# Altium project UZ_D_Resolver.PrjPCB (part 1 of 2)
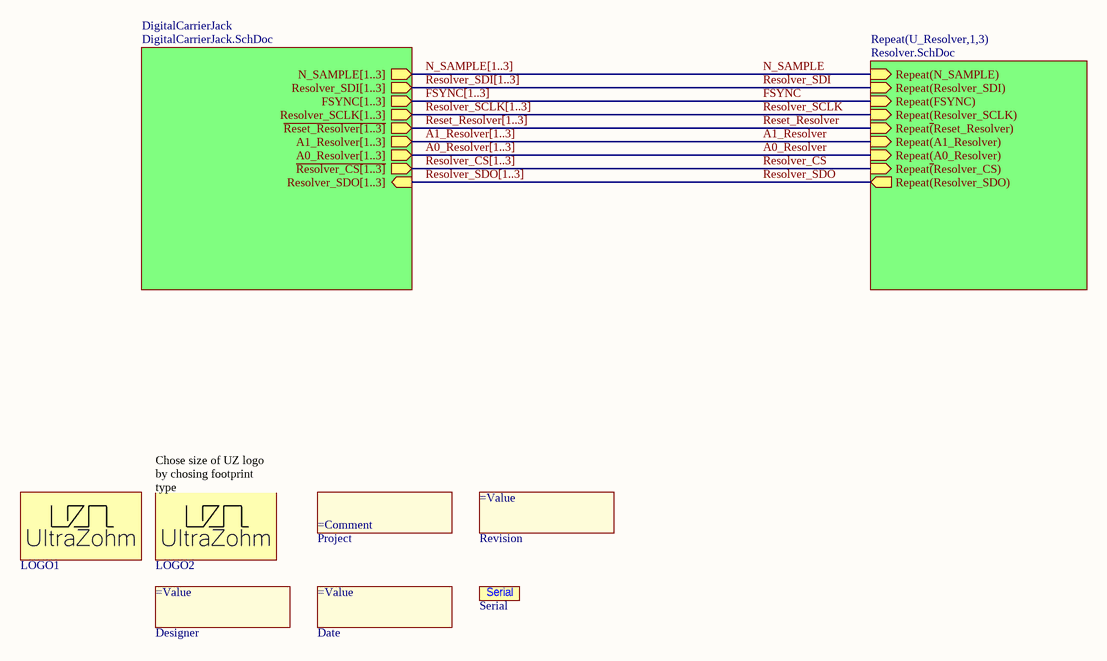
[diagram p0: TopSheet.SchDoc]
Author: M. Bauer / A. Geiger; AuthorParam: M. Bauer / A. Geiger; FinDate: 12/2023; ProjectNameCustom: UZ_D_Resolver; ProjectRevision: Rev02
6 sheets, 372 parts. Net scope: hierarchical (ports join the sheet entries above them; power ports are global).
Board file: UltraZohm_Digital_Resolver.PcbDoc
Sheets:
  TopSheet.SchDoc
    DigitalCarrierJack = DigitalCarrierJack.SchDoc
    U_Resolver1 = Resolver.SchDoc
      Buffer_EXC = Buffer_EXC.SchDoc
      Impedance Converter = Impedance converter.SchDoc
      U_Resolver fuses = Resolver fuses.SchDoc
    U_Resolver2 = Resolver.SchDoc
      Buffer_EXC = Buffer_EXC.SchDoc
      Impedance Converter = Impedance converter.SchDoc
      U_Resolver fuses = Resolver fuses.SchDoc
    U_Resolver3 = Resolver.SchDoc
      Buffer_EXC = Buffer_EXC.SchDoc
      Impedance Converter = Impedance converter.SchDoc
      U_Resolver fuses = Resolver fuses.SchDoc

## Sheet TopSheet.SchDoc: Resolver
size A4; Author: M. Bauer / A. Geiger; CompanyName: Technische Hochschule Nürnberg Georg Simon Ohm; DrawnBy: Bauer Martin; Engineer: Bauer Martin; Organization: UltraZohm; Address1: Kesslerplatz 12; Address2: 90489 Nürnberg; Address3: GERMANY; DocumentNumber: 1; Revision: A; SheetNumber: 1; SheetTotal: 6; Website: www.ultrazohm.com

### Parts
Date  (no value)  [COMMENT]  (no BOM)
Designer  (no value)  [Designator:comment]  (no BOM)
LOGO1  UZ Logo  [UZ_Logo_large]  (value not drawn)  (no BOM)
LOGO2  UZ Logo  [UZ_Logo_tiny]  (value not drawn)  (no BOM)
Project  (no value)  [COMMENT]  (no BOM)
Revision  (no value)  [Designator:comment]  (no BOM)
Serial  Serial #  [SERIAL]  (value not drawn)

### Sub-sheets
DigitalCarrierJack = DigitalCarrierJack.SchDoc: ~{Resolver_CS[1..3]} (out), A1_Resolver[1..3] (out), ~{Reset_Resolver[1..3]} (out), FSYNC[1..3] (out), N_SAMPLE[1..3] (out), A0_Resolver[1..3] (out), Resolver_SCLK[1..3] (out), Resolver_SDO[1..3] (in), Resolver_SDI[1..3] (out)
Repeat(U_Resolver,1,3) = Resolver.SchDoc: Repeat(N_SAMPLE) (in), Repeat(Resolver_SDO) (out), Repeat(Resolver_SDI) (in), Repeat(FSYNC) (in), Repeat(Resolver_SCLK) (in), Repeat~{(}Reset_Resolver) (in), Repeat(A1_Resolver) (in), Repeat(A0_Resolver) (in), Repeat~{(}Resolver_CS) (in)

### Nets
~{Reset_Resolver}: sheet Repeat(U_Resolver,1,3)/Repeat~{(}Reset_Resolver)
~{Resolver_CS}: sheet Repeat(U_Resolver,1,3)/Repeat~{(}Resolver_CS)
A0_Resolver: sheet Repeat(U_Resolver,1,3)/Repeat(A0_Resolver)
A1_Resolver: sheet Repeat(U_Resolver,1,3)/Repeat(A1_Resolver)
FSYNC: sheet Repeat(U_Resolver,1,3)/Repeat(FSYNC)
N_SAMPLE: sheet Repeat(U_Resolver,1,3)/Repeat(N_SAMPLE)
Resolver_SCLK: sheet Repeat(U_Resolver,1,3)/Repeat(Resolver_SCLK)
Resolver_SDI: sheet Repeat(U_Resolver,1,3)/Repeat(Resolver_SDI)
Resolver_SDO: sheet Repeat(U_Resolver,1,3)/Repeat(Resolver_SDO)

### Buses and harness runs
bus A0_Resolver[1..3] = sheet DigitalCarrierJack/A0_Resolver[1..3]
bus A1_Resolver[1..3] = sheet DigitalCarrierJack/A1_Resolver[1..3]
bus FSYNC[1..3] = sheet DigitalCarrierJack/FSYNC[1..3]
bus N_SAMPLE[1..3] = sheet DigitalCarrierJack/N_SAMPLE[1..3]
bus Resolver_SCLK[1..3] = sheet DigitalCarrierJack/Resolver_SCLK[1..3]
bus Resolver_SDI[1..3] = sheet DigitalCarrierJack/Resolver_SDI[1..3]
bus Resolver_SDO[1..3] = sheet DigitalCarrierJack/Resolver_SDO[1..3]
bus ~{Reset_Resolver[1..3]} = sheet DigitalCarrierJack/~{Reset_Resolver[1..3]}
bus ~{Resolver_CS[1..3]} = sheet DigitalCarrierJack/~{Resolver_CS[1..3]}

### Notes on the sheet
- (near LOGO2) Chose size of UZ logo by chosing footprint type
- Title
- Revision:
- Design Engineer:
- Date:
- Project:
- Sheet
- of

### Library data of the parts
Date = 5: Create a project parameter named "FinDate" this is the value of this component. It is printed on the PCB. Once the parameter is updated (e.g. new revision) it gets updated on the PCB as well; Manufacturer: PCB Manufacturer; Manufacturer Part Number: Project End Date; Value: 12/2023; Created from: T. Wendt; PartID: 5; Created On: 01.03.2021 09:01:41; Component Type: Date of Project Finalization; Last Updated: 01.03.2021 09:01:41; Type: Standard (No BOM); Live Cycle Status: 1
Designer = 4: Create a project parameter named "Author" this is the value of this component. It is printed on the PCB. Once the parameter is updated (e.g. new revision) it gets updated on the PCB as well; Manufacturer: PCB Manufacturer; Manufacturer Part Number: Project Author; Value: M. Bauer / A. Geiger; Created from: T. Wendt; PartID: 4; Created On: 01.03.2021 08:53:41; Component Type: Project Author; Last Updated: 01.03.2021 09:20:27; Type: Standard (No BOM); Live Cycle Status: 1
LOGO1 LOGO2 = 1: Official Project Logo of the UltraZohm; Manufacturer: PCB Manufacturer; Manufacturer Part Number: UltraZohm Logo; Created from: T. Wendt; PartID: 1; Created On: 19.02.2021 16:55:56; ComponentLink1Description: Homepage; ComponentLink1URL: https://ultrazohm.com; Component Type: Logo; Last Updated: 02.03.2021 14:31:24; Type: Standard (No BOM); Live Cycle Status: 1
Project = 2: Create a project parameter named "ProjectNameCustom" this is the value of this component and it is printed on the PCB.; Manufacturer: PCB Manufacturer; Value: UZ_D_Resolver; Created from: T. Wendt; PartID: 2; Created On: 01.03.2021 08:43:57; Component Type: Project Name; Last Updated: 01.03.2021 09:07:27; Manufacturer Part Number: Project Name; Type: Standard (No BOM); Live Cycle Status: 1
Revision = 3: Create a project parameter named "ProjectRevision" this is the value of this component. It is printed on the PCB. Once the parameter is updated (e.g. new revision) it gets updated on the PCB as well; Manufacturer: PCB Manufacturer; Value: Rev02; Created from: T. Wendt; PartID: 3; Created On: 01.03.2021 08:50:34; Component Type: Project Revision; Last Updated: 01.03.2021 09:28:36; Manufacturer Part Number: Project Revision; Type: Standard (No BOM); Live Cycle Status: 1
Serial = 6: Field to put in a serial number; Manufacturer: PCB Manufacturer; Created from: T. Wendt; PartID: 6; Created On: 02.03.2021 14:31:24; Component Type: Serial Number; Last Updated: 02.03.2021 14:31:24; Manufacturer Part Number: Serial Number; Type: Standard (No BOM); Live Cycle Status: 1

## Sheet DigitalCarrierJack.SchDoc
size A4; Author: M. Bauer / A. Geiger; CompanyName: Technische Hochschule Nürnberg Georg Simon Ohm; DrawnBy: Bauer Martin; Engineer: Bauer Martin; Organization: UltraZohm; Address1: Kesslerplatz 12; Address2: 90489 Nürnberg; Address3: GERMANY; DocumentNumber: 2; SheetNumber: 2; SheetTotal: 6; Website: www.ultrazohm.com
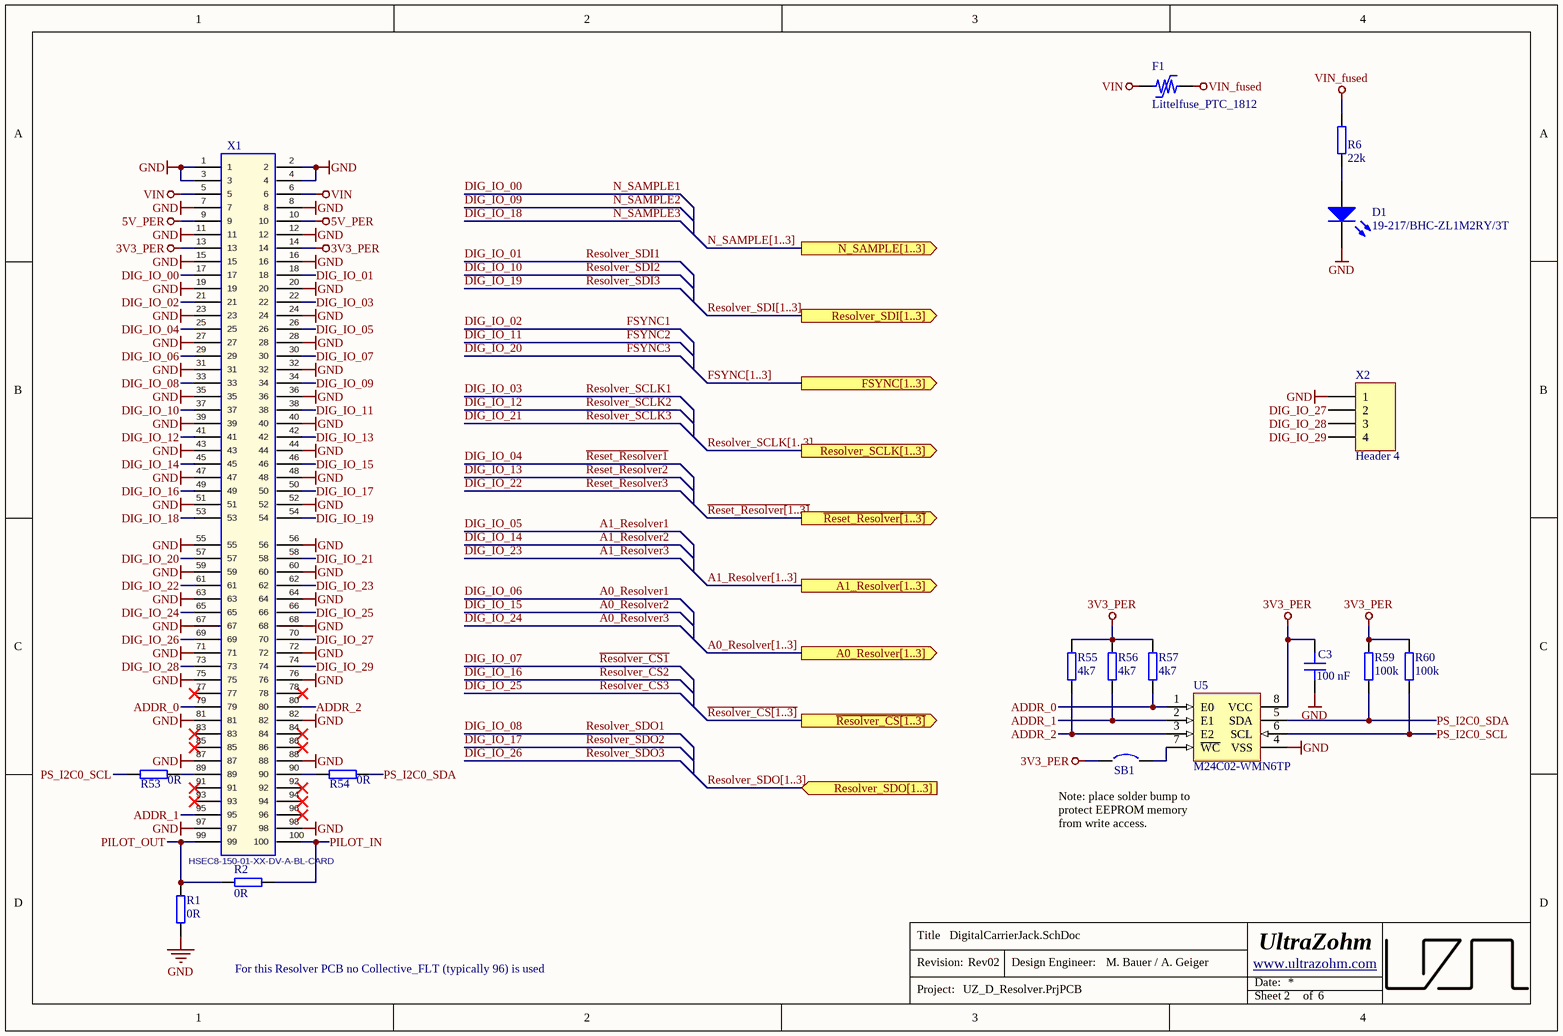
[diagram p1: DigitalCarrierJack.SchDoc]

### Parts
C3  100 nF  [C_0603]
D1  19-217/BHC-ZL1M2RY/3T  [WL-SMCW_0603]
F1  Littelfuse_PTC_1812  [1812_PTC_Polyfuse_Littelfuse]
R1  0R  [RES 0603_1608]
R2  0R  [RES 0603_1608]
R6  22k  [RES 0603_1608]
R53  0R  [RES 0603_1608]
R54  0R  [RES 0603_1608]
R55  4k7  [RES 0603_1608]
R56  4k7  [RES 0603_1608]
R57  4k7  [RES 0603_1608]
R59  100k  [RES 0603_1608]
R60  100k  [RES 0603_1608]
SB1  Solder Bump 0603  [SB_0603]  (value not drawn)  (no BOM)
U5  M24C02-WMN6TP  [D0008A_N]
X1  HSEC8-150-01-XX-DV-A-BL-CARD  [HSEC8-150-01-XX-DV-A-BL-CARD]  (no BOM)
X2  Header 4  [HDR1X4]

### Ports
A0_Resolver[1..3] (out), A1_Resolver[1..3] (out), FSYNC[1..3] (out), N_SAMPLE[1..3] (out), Resolver_SCLK[1..3] (out), Resolver_SDI[1..3] (out), Resolver_SDO[1..3] (in), ~{Reset_Resolver[1..3]} (out), ~{Resolver_CS[1..3]} (out)

### Nets
3V3_PER: C3.1 R55.2 R56.2 R57.2 R59.2 R60.2 SB1.1 U5.8(VCC) X1.13 X1.14
5V_PER: X1.9 X1.10
GND: C3.2 D1.1(K) R1.1 U5.4(VSS) X1.1 X1.2 X1.3 X1.4 X1.7 X1.8 X1.11 X1.12 X1.15 X1.16 X1.19 X1.20 X1.23 X1.24 X1.27 X1.28 X1.31 X1.32 X1.35 X1.36 X1.39 X1.40 X1.43 X1.44 X1.47 X1.48 X1.51 X1.52 X1.55 X1.56 X1.59 X1.60 X1.63 X1.64 X1.67 X1.68 X1.71 X1.72 X1.75 X1.76 X1.81 X1.82 X1.87 X1.88 X1.97 X1.98 X2.1
VIN: F1.1 X1.5 X1.6
VIN_fused: F1.2 R6.2
~{Reset_Resolver1}: X1.25  [also labelled DIG_IO_04]  [project net ~{Reset_Resolver}]
~{Reset_Resolver2}: X1.42  [also labelled DIG_IO_13]  [project net ~{Reset_Resolver}]
~{Reset_Resolver3}: X1.61  [also labelled DIG_IO_22]  [project net ~{Reset_Resolver}]
~{Resolver_CS1}: X1.30  [also labelled DIG_IO_07]  [project net ~{Resolver_CS}]
~{Resolver_CS2}: X1.49  [also labelled DIG_IO_16]  [project net ~{Resolver_CS}]
~{Resolver_CS3}: X1.66  [also labelled DIG_IO_25]  [project net ~{Resolver_CS}]
A0_Resolver1: X1.29  [also labelled DIG_IO_06]
A0_Resolver2: X1.46  [also labelled DIG_IO_15]
A0_Resolver3: X1.65  [also labelled DIG_IO_24]
A1_Resolver1: X1.26  [also labelled DIG_IO_05]
A1_Resolver2: X1.45  [also labelled DIG_IO_14]
A1_Resolver3: X1.62  [also labelled DIG_IO_23]
ADDR_0: R57.1 U5.1(E0) X1.79
ADDR_1: R56.1 U5.2(E1) X1.95
ADDR_2: R55.1 U5.3(E2) X1.80
DIG_IO_00: X1.17  [also labelled N_SAMPLE1]
DIG_IO_01: X1.18  [also labelled Resolver_SDI1]
DIG_IO_02: X1.21  [also labelled FSYNC1]
DIG_IO_03: X1.22  [also labelled Resolver_SCLK1]
DIG_IO_08: X1.33  [also labelled Resolver_SDO1]
DIG_IO_09: X1.34  [also labelled N_SAMPLE2]
DIG_IO_10: X1.37  [also labelled Resolver_SDI2]
DIG_IO_11: X1.38  [also labelled FSYNC2]
DIG_IO_12: X1.41  [also labelled Resolver_SCLK2]
DIG_IO_17: X1.50  [also labelled Resolver_SDO2]
DIG_IO_18: X1.53  [also labelled N_SAMPLE3]
DIG_IO_19: X1.54  [also labelled Resolver_SDI3]
DIG_IO_20: X1.57  [also labelled FSYNC3]
DIG_IO_21: X1.58  [also labelled Resolver_SCLK3]
DIG_IO_26: X1.69  [also labelled Resolver_SDO3]
DIG_IO_27: X1.70 X2.2
DIG_IO_28: X1.73 X2.3
DIG_IO_29: X1.74 X2.4
PILOT_IN: R2.2 X1.100
PILOT_OUT: R1.2 R2.1 X1.99
PS_I2C0_SCL: R53.1 R60.1 U5.6(SCL)
PS_I2C0_SDA: R54.2 R59.1 U5.5(SDA)
NetD1_2: D1.2(A) R6.1
NetR53_2: R53.2 X1.89
NetR54_1: R54.1 X1.90
NetSB1_2: SB1.2 U5.7(~{WC})

Not connected (* = marked no-connect by the designer): X1 77* 78* 83* 84* 85* 86* 91* 92* 93* 94* 96*

### Buses and harness runs
bus A0_Resolver[1..3] = port A0_Resolver[1..3]
bus A1_Resolver[1..3] = port A1_Resolver[1..3]
bus FSYNC[1..3] = port FSYNC[1..3]
bus N_SAMPLE[1..3] = port N_SAMPLE[1..3]
bus Resolver_SCLK[1..3] = port Resolver_SCLK[1..3]
bus Resolver_SDI[1..3] = port Resolver_SDI[1..3]
bus Resolver_SDO[1..3] = port Resolver_SDO[1..3]
bus ~{Reset_Resolver[1..3]} = port ~{Reset_Resolver[1..3]}
bus ~{Resolver_CS[1..3]} = port ~{Resolver_CS[1..3]}

### Notes on the sheet
- Note: place solder bump to protect EEPROM memory from write access.
- For this Resolver PCB no Collective_FLT (typically 96) is used
- Title
- Revision:
- Design Engineer:
- Date:
- Project:
- Sheet
- of

### Library data of the parts
C3 = C0603C104K9PACTU: Capacitor 0603, 6.3 VDC, 100 nF, X5R; Manufacturer: KEMET; Tolerance: 10 %; Voltage Rating: 6.3 VDC; Created from: MGremer; Manufacturer Part Number: C0603C104K9PACTU; PartID: 70; Created On: 20.12.2020 13:54:13; ComponentLink1Description: Datasheet; ComponentLink1URL: https://www.mouser.de/datasheet/2/212/KEM_C1006_X5R_SMD-1103249.pdf; Component Type: Capacitor 0603; Device Package: 0603; Last Updated: 20.01.2021 13:57:36; Mounting Type: SMD; Operating Temperature: -55 - 85°C; Series: SMD Comm X5R; Supplier 1: Mouser; Supplier Part Number 1: 80-C0603C104K9P; Type: Capacitor; Value: 100 nF; Live Cycle Status: 1; Stock number: not stored
D1 = 19-217/BHC-ZL1M2RY/3T: LED BLUE 465~475NM 11.5~28.5MCD@5MA TOP VIEW 0603 ROHS; Manufacturer: Everlight Elec; Type: Standard; Created from: T. Wendt; Forward Current I_f: 20 mA; Forward Voltage U_f: 2.8 V; Wavelength: 470 nm; Nominal Power: 68 mW; Manufacturer Part Number: 19-217/BHC-ZL1M2RY/3T; PartID: 6; Created On: 03.03.2021 09:59:51; ComponentLink1Description: Datasheet; ComponentLink1URL: https://datasheet.lcsc.com/szlcsc/Everlight-Elec-19-217-BHC-ZL1M2RY-3T_C72041.pdf; Component Type: LED Diode; Device Package: 0603; Last Updated: 04.03.2021 09:02:49; Mounting Type: SMD; Operating Temperature: -40 - 85 °C; Supplier 1: LCSC; Supplier Part Number 1: C72041; Live Cycle Status: 1; Stock number: not stored; Color: blue; Light Intensity: 28.5 mcd; LCSC Part Number: C72041
F1 = Littelfuse_PTC_1812: POLYSWITCH RESETTABLE DEVICES; MPN: miniASMDC110F/24; Value: PTC, 1.1 A, 24V; Voltage: 24V; Trip Current: 2.2A; Hold Current: 1.1A; Resistance: 0.18 Ohm; Type: Fuse; Nominal current: 1 A; Created from: MHlatky; MF: Littelfuse; Created: 2019_02_10_AGeiger; Package: 1812; ComponentLink1URL: https://www.littelfuse.com/~/media/electronics/datasheets/resettable_ptcs/littelfuse_ptc_surface_mount_catalog_datasheet.pdf.pdf; ComponentLink1Description: Datasheet; Manufacturer Part Number: Littelfuse_PTC_1812; PartID: 5; Created On: 07.05.2021 06:50:33; Component Type: Littelfuse_PTC_1812; Last Updated: 27.05.2022 15:06:17; Manufacturer: Littelfuse; Mounting Type: SMD; Operating Temperature: -40 - 85 °C; Supplier 1: Mouser; Supplier Part Number 1: 530-0ZCG0150BF2C; Live Cycle Status: 1; LCSC Part Number: C70119
R1 R2 R53 R54 = RC0603JR-070RL: SMD resistor E24 series; Manufacturer: YAGEO; Tolerance: 5%; Created from: MGremer; Supplier 1: Mouser; ComponentLink1Description: Datasheet; ComponentLink1URL: https://www.mouser.de/datasheet/2/447/PYu-RC_Group_51_RoHS_L_10-1664068.pdf; Value: 0R; Supplier Part Number 1: 603-RC0603JR-070RL; Manufacturer Part Number: RC0603JR-070RL; PartID: 1; Created On: 14.12.2020 16:17:14; Component Type: SMD resistor; Device Package: 0603; Last Updated: 04.03.2021 09:09:42; Mounting Type: SMD; Supplier 2: LCSC; Supplier Part Number 2: C21189; Type: Resistor; Live Cycle Status: 1; Stock number: Labor SMD Container; LCSC Part Number: C21189
R6 = RK73B1JTTD223J: SMD resistor E24 series; Manufacturer: KOA Speer; Tolerance: 5%; Created from: MGremer; Value: 22k; Supplier 1: Mouser; Supplier Part Number 1: 660-RK73B1JTTD223J; Manufacturer Part Number: RK73B1JTTD223J; PartID: 106; Created On: 14.12.2020 16:17:14; ComponentLink1Description: Datasheet; ComponentLink1URL: https://www.mouser.de/datasheet/2/219/RK73B-1825463.pdf; Component Type: SMD resistor; Device Package: 0603; Last Updated: 01.02.2023 09:52:31; Mounting Type: SMD; Type: Resistor; Live Cycle Status: 1; Stock number: Labor SMD Container; LCSC Part Number: C31850
R55-R57 = 0603WAF4701T5E: SMD resistor E24 series; Manufacturer: UNI-ROYAL; Tolerance: 1%; Created from: AGeiger; Manufacturer Part Number: 0603WAF4701T5E; PartID: 90; Created On: 14.12.2020 16:17:14; ComponentLink1Description: Datasheet; ComponentLink1URL: https://datasheet.lcsc.com/lcsc/2206010116_UNI-ROYAL-Uniroyal-Elec-0603WAF4701T5E_C23162.pdf; Component Type: SMD resistor; Device Package: 0603; Last Updated: 25.08.2022 20:03:04; Mounting Type: SMD; Supplier 1: LCSC; Supplier Part Number 1: C23162; Type: Resistor; Value: 4k7; Live Cycle Status: 1; Stock number: Labor SMD Container; LCSC Part Number: C23162
R59 R60 = RK73B1JTTD104J: SMD resistor E24 series; Manufacturer: KOA Speer; Tolerance: 5%; Created from: MGremer; Manufacturer Part Number: RK73B1JTTD104J; PartID: 122; Created On: 14.12.2020 16:17:14; ComponentLink1Description: Datasheet; ComponentLink1URL: https://www.mouser.de/datasheet/2/219/RK73B-1825463.pdf; Component Type: SMD resistor; Device Package: 0603; Last Updated: 27.05.2022 14:04:10; Mounting Type: SMD; Supplier 1: Mouser; Supplier Part Number 1: 660-RK73B1JTTD104J; Type: Resistor; Value: 100k; Live Cycle Status: 1; Stock number: Labor SMD Container; LCSC Part Number: C25803
SB1 = =Value: Created from: AGeiger; Revision: July-2002: Re-released for DXP Platform.; PartID: 1; Created On: 09.01.2024 17:13:56; Component Type: Solder Bump; Device Package: 0603; Last Updated: 09.01.2024 17:13:56; Manufacturer Part Number: Solder Bump 0603; Mounting Type: SMD; Value: Solder Bump 0603
U5 = M24C02-WMN6TP: 2Kbit I2C SOP-8 EEPROM ROHS; Manufacturer: STMicroelectronics; Created from: AGeiger; Manufacturer Part Number: M24C02-WMN6TP; PartID: 1; Created On: 19.11.2023 14:54:27; ComponentLink1Description: Datasheet; ComponentLink1URL: https://www.st.com/resource/en/datasheet/m24c01-w.pdf; Component Type: EEPROM; Device Package: SOIC-8; Last Updated: 19.11.2023 21:39:04; Mounting Type: SMD; Operating Temperature: -40 to +85 °C; Series: M24xxx; Supplier 1: Mouser; Supplier Part Number 1: 511-M24C02-WMN6TP; Supplier 2: LCSC; Supplier Part Number 2: C7562; Type: Memory; Value: M24C02-WMN6TP; LCSC Part Number: C7562
X1 = HSEC8-150-01-XX-DV-A-BL-CARD: Mating Card Layout for HSEC8-150-01-XX-DV-A-BL; Manufacturer: SAMTEC; Created: 2018_04_23_AGeiger; Value: HSEC8-150-01-XX-DV-A-BL-CARD
X2 = Header 4: Header, 4-Pin; LatestRevisionDate: 17-Jul-2002; LatestRevisionNote: Re-released for DXP Platform.; Publisher: Altium Limited

## Sheet Resolver.SchDoc
size A4; Author: M. Bauer / A. Geiger; CompanyName: Technische Hochschule Nürnberg Georg Simon Ohm; DrawnBy: Bauer Martin; Engineer: Bauer Martin; Organization: UltraZohm; Address1: Kesslerplatz 12; Address2: 90489 Nürnberg; Address3: GERMANY; DocumentNumber: 3; SheetNumber: 3; SheetTotal: 6; Website: www.ultrazohm.com
Used 3 times, as channels U_Resolver1, U_Resolver2, U_Resolver3. Parts and nets are listed once, with the designators drawn on the sheet.
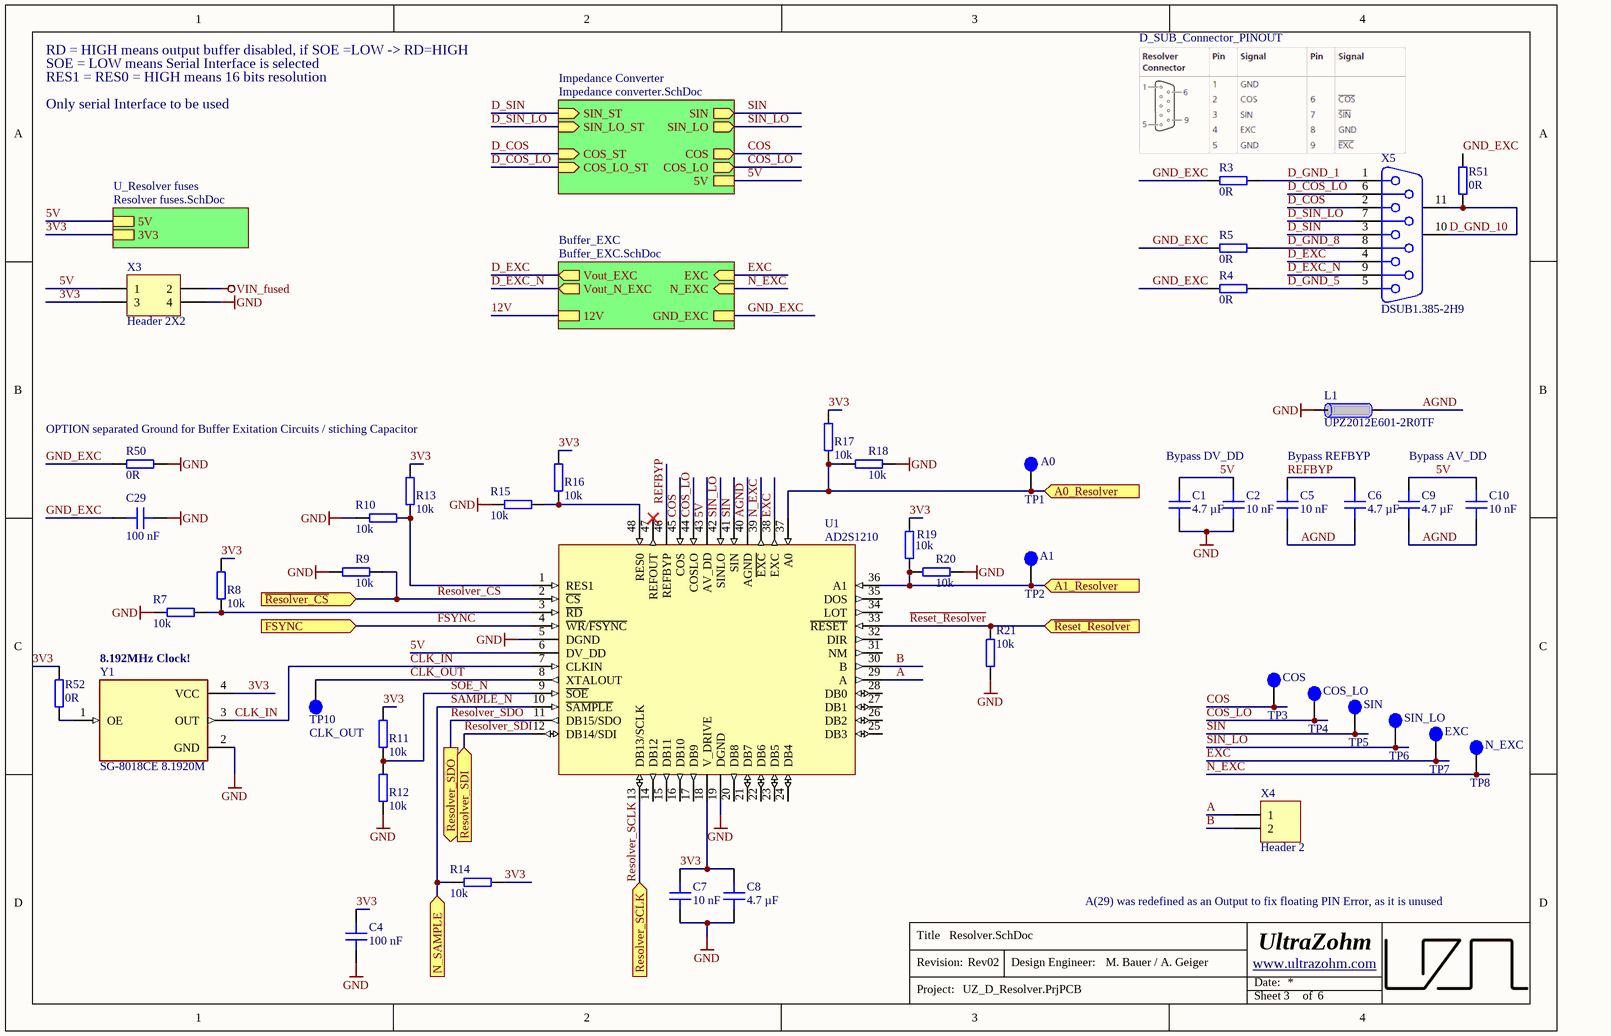
[diagram p2: Resolver.SchDoc]

### Parts
C1  4.7 µF  [C_0603]
C2  10 nF  [C_0603]
C4  100 nF  [C_0603]
C5  10 nF  [C_0603]
C6  4.7 µF  [C_0603]
C7  10 nF  [C_0603]
C8  4.7 µF  [C_0603]
C9  4.7 µF  [C_0603]
C10  10 nF  [C_0603]
C29  100 nF  [C_0603]
L1  UPZ2012E601-2R0TF  [INDC2012X92N_V]
R3  0R  [RES 0603_1608]
R4  0R  [RES 0603_1608]
R5  0R  [RES 0603_1608]
R7  10k  [RES 0603_1608]
R8  10k  [RES 0603_1608]
R9  10k  [RES 0603_1608]
R10  10k  [RES 0603_1608]
R11  10k  [RES 0603_1608]
R12  10k  [RES 0603_1608]
R13  10k  [RES 0603_1608]
R14  10k  [RES 0603_1608]
R15  10k  [RES 0603_1608]
R16  10k  [RES 0603_1608]
R17  10k  [RES 0603_1608]
R18  10k  [RES 0603_1608]
R19  10k  [RES 0603_1608]
R20  10k  [RES 0603_1608]
R21  10k  [RES 0603_1608]
R50  0R  [RES 0603_1608]
R51  0R  [RES 0603_1608]
R52  0R  [RES 0603_1608]
TP1  A0  [TP_1mm]  (no BOM)
TP2  A1  [TP_1mm]  (no BOM)
TP3  COS  [TP_1mm]  (no BOM)
TP4  COS_LO  [TP_1mm]  (no BOM)
TP5  SIN  [TP_1mm]  (no BOM)
TP6  SIN_LO  [TP_1mm]  (no BOM)
TP7  EXC  [TP_1mm]  (no BOM)
TP8  N_EXC  [TP_1mm]  (no BOM)
TP10  CLK_OUT  [TP_1mm]  (no BOM)
U1  AD2S1210  [LQFP-48_L]
X3  Header 2X2  [HDR2X2]
X4  Header 2  [HDR1X2]
X5  DSUB1.385-2H9  [DSUB1.385-2H9]
Y1  SG-8018CE 8.1920M  [OSCCC320X250X120N]

### Sub-sheets
Buffer_EXC = Buffer_EXC.SchDoc: Vout_EXC (out), Vout_N_EXC (out), N_EXC (in), EXC (in), GND_EXC, 12V
Impedance Converter = Impedance converter.SchDoc: SIN_LO (out), COS_LO_ST (in), SIN_ST (in), SIN_LO_ST (in), COS_ST (in), SIN (out), COS_LO (out), COS (out), 5V
U_Resolver fuses = Resolver fuses.SchDoc: 5V, 3V3

### Ports
A0_Resolver (in), A1_Resolver (in), FSYNC (in), N_SAMPLE (in), Resolver_SCLK (in), Resolver_SDI (in), Resolver_SDO (out), ~{Reset_Resolver} (in), ~{Resolver_CS} (in)

### Nets
GND: C1.1 C2.1 C4.1 C7.1 C8.1 C29.2 L1.2 R7.1 R9.2 R10.1 R12.1 R15.1 R18.1 R20.1 R21.2 R50.2 U1.5(DGND) U1.19(DGND) X3.4 Y1.2(GND)
VIN_fused: X3.2
3V3: C4.2 C7.2 C8.2 R8.2 R11.2 R13.2 R14.2 R16.2 R17.2 R19.2 R52.2 U1.18(V_DRIVE) X3.3 Y1.4(VCC) ; sheet U_Resolver fuses/3V3
5V: C1.2 C2.2 C9.1 C10.1 U1.6(DV_DD) U1.43(AV_DD) X3.1 ; sheet Impedance Converter/5V, sheet U_Resolver fuses/5V
12V: sheet Buffer_EXC/12V
~{Reset_Resolver}: R21.1 U1.33(~{RESET}) ; port ~{Reset_Resolver}
~{Resolver_CS}: R9.1 U1.2(~{CS}) ; port ~{Resolver_CS}
A: U1.29(A) X4.1
A0_Resolver: R17.1 R18.2 TP1.1 U1.37(A0) ; port A0_Resolver
A1_Resolver: R19.1 R20.2 TP2.1 U1.36(A1) ; port A1_Resolver
AGND: C5.2 C6.1 C9.2 C10.2 L1.1 U1.40(AGND)
B: U1.30(B) X4.2
CLK_IN: U1.7(CLKIN) Y1.3(OUT)
CLK_OUT: TP10.1 U1.8(XTALOUT)
COS: TP3.1 U1.45(COS) ; sheet Impedance Converter/COS
COS_LO: TP4.1 U1.44(COSLO) ; sheet Impedance Converter/COS_LO
D_COS: X5.2 ; sheet Impedance Converter/COS_ST
D_COS_LO: X5.6 ; sheet Impedance Converter/COS_LO_ST
D_EXC: X5.4 ; sheet Buffer_EXC/Vout_EXC
D_EXC_N: X5.9 ; sheet Buffer_EXC/Vout_N_EXC
D_GND_1: R3.1 X5.1
D_GND_5: R4.1 X5.5
D_GND_8: R5.1 X5.8
D_GND_10: R51.2 X5.10(MH1) X5.11(MH2)
D_SIN: X5.3 ; sheet Impedance Converter/SIN_ST
D_SIN_LO: X5.7 ; sheet Impedance Converter/SIN_LO_ST
EXC: TP7.1 U1.38(EXC) ; sheet Buffer_EXC/EXC
FSYNC: U1.4(~{WR}/~{FSYNC}) ; port FSYNC
GND_EXC: C29.1 R3.2 R4.2 R5.2 R50.1 R51.1 ; sheet Buffer_EXC/GND_EXC
N_EXC: TP8.1 U1.39(~{EXC}) ; sheet Buffer_EXC/N_EXC
REFBYP: C5.1 C6.2 U1.46(REFBYP)
Resolver_SCLK: U1.13(DB13/SCLK) ; port Resolver_SCLK
Resolver_SDI: U1.12(DB14/SDI) ; port Resolver_SDI
Resolver_SDO: U1.11(DB15/SDO) ; port Resolver_SDO
SAMPLE_N: R14.1 U1.10(~{SAMPLE}) ; port N_SAMPLE
SIN: TP5.1 U1.41(SIN) ; sheet Impedance Converter/SIN
SIN_LO: TP6.1 U1.42(SINLO) ; sheet Impedance Converter/SIN_LO
SOE_N: R11.1 R12.2 U1.9(~{SOE})
NetR7_2: R7.2 R8.1 U1.3(~{RD})
NetR10_2: R10.2 R13.1 U1.1(RES1)
NetR15_2: R15.2 R16.1 U1.48(RES0)
NetR52_1: R52.1 Y1.1(OE)

Not connected (* = marked no-connect by the designer): U1 14(DB12) 15(DB11) 16(DB10) 17(DB9) 20(DB8) 21(DB7) 22(DB6) 23(DB5) 24(DB4) 25(DB3) 26(DB2) 27(DB1) 28(DB0) 31(NM) 32(DIR) 34(LOT) 35(DOS) 47(REFOUT)*

### Channels
U_Resolver1: designators end in A; ports A0_Resolver=A0_Resolver1 A1_Resolver=A1_Resolver1 FSYNC=DIG_IO_02 N_SAMPLE=DIG_IO_00 Resolver_SCLK=DIG_IO_03 Resolver_SDI=DIG_IO_01 Resolver_SDO=DIG_IO_08 ~{Reset_Resolver}=~{Reset_Resolver} ~{Resolver_CS}=~{Resolver_CS}
U_Resolver2: designators end in B; ports A0_Resolver=A0_Resolver2 A1_Resolver=A1_Resolver2 FSYNC=DIG_IO_11 N_SAMPLE=DIG_IO_09 Resolver_SCLK=DIG_IO_12 Resolver_SDI=DIG_IO_10 Resolver_SDO=DIG_IO_17 ~{Reset_Resolver}=~{Reset_Resolver} ~{Resolver_CS}=~{Resolver_CS}
U_Resolver3: designators end in C; ports A0_Resolver=A0_Resolver3 A1_Resolver=A1_Resolver3 FSYNC=DIG_IO_20 N_SAMPLE=DIG_IO_18 Resolver_SCLK=DIG_IO_21 Resolver_SDI=DIG_IO_19 Resolver_SDO=DIG_IO_26 ~{Reset_Resolver}=~{Reset_Resolver} ~{Resolver_CS}=~{Resolver_CS}

### Notes on the sheet
- D_SUB_Connector_PINOUT
- RD = HIGH means output buffer disabled, if SOE =LOW -> RD=HIGH
- RES1 = RES0 = HIGH means 16 bits resolution
- SOE = LOW means Serial Interface is selected
- Only serial Interface to be used
- OPTION separated Ground for Buffer Exitation Circuits / stiching Capacitor
- Bypass DV_DD
- Bypass REFBYP
- Bypass AV_DD
- 8.192MHz Clock!
- A(29) was redefined as an Output to fix floating PIN Error, as it is unused
- Title
- Revision:
- Design Engineer:
- Date:
- Project:
- Sheet
- of

### Library data of the parts
C1 C6 C8 C9 = GRM188R6YA475KE15D: Capacitor 0603, 35 VDC, 4.7 µF, X5R; Manufacturer: muRata; Tolerance: 10 %; Voltage Rating: 16 VDC; Created from: MGremer; Value: 4.7 µF; Supplier 1: Mouser; Supplier Part Number 1: 81-GRM188R6YA475KE5D; Manufacturer Part Number: GRM188R6YA475KE15D; PartID: 11; Created On: 20.12.2020 13:54:13; ComponentLink1Description: Datasheet; ComponentLink1URL: https://www.mouser.de/datasheet/2/281/murata_03052018_GRM_Series_1-1310166.pdf; Component Type: Capacitor 0603; Device Package: 0603; Last Updated: 20.12.2020 16:34:30; Mounting Type: SMD; Operating Temperature: -55 - 85°C; Series: GRM; Type: Capacitor; Live Cycle Status: 1; Stock number: Labor SMD Container; LCSC Part Number: C19666
C2 C5 C7 C10 = 0603B103K500NT: 50V 10nF X7R ±10% 0603  Multilayer Ceramic Capacitors MLCC - SMD/SMT ROHS; Manufacturer: FH (Guangdong Fenghua Advanced Tech); Voltage Rating: 50 VDC; Created from: AGeiger; Value: 10 nF; Supplier 1: LCSC; Supplier Part Number 1: C57112; Manufacturer Part Number: 0603B103K500NT; PartID: 108; Created On: 21.09.2022 07:22:21; ComponentLink1Description: Datasheet; ComponentLink1URL: https://datasheet.lcsc.com/lcsc/2102081402_FH--Guangdong-Fenghua-Advanced-Tech-0603B103K500NT_C57112.pdf; Component Type: Capacitor 0603; Device Package: 0603; Last Updated: 21.09.2022 07:22:21; Mounting Type: SMD; Operating Temperature: -55 - 125°C; Series: X7R; Type: Capacitor; Tolerance: 10 %; Live Cycle Status: 1; LCSC Part Number: C57112
C4 C29 = CC0603KRX7R9BB104: Capacitor 0603, 50 VDC, 100 nF, X7R; Manufacturer: YAGEO; Tolerance: 10 %; Voltage Rating: 50 VDC; Created from: AGeiger; Manufacturer Part Number: CC0603KRX7R9BB104; PartID: 102; Created On: 22.08.2022 14:35:53; ComponentLink1Description: Datasheet; ComponentLink1URL: https://datasheet.lcsc.com/lcsc/1809301912_YAGEO-CC0603KRX7R9BB104_C14663.pdf; Component Type: Capacitor 0603; Device Package: 0603; Last Updated: 22.08.2022 14:35:53; Mounting Type: SMD; Operating Temperature: -55 - 125°C; Series: X7R; Supplier 1: LCSC; Supplier Part Number 1: C14663; Supplier 2: Mouser; Supplier Part Number 2: 603-CC603KRX7R9BB104; Type: Capacitor; Value: 100 nF; Live Cycle Status: 1; LCSC Part Number: C14663
L1 = UPZ2012E601-2R0TF: 2A 1 90mΩ 600Ω@100MHz ±25% 0805  Ferrite Beads ROHS; Manufacturer: Sunlord; Value: 90 Ohm; Created from: AGeiger; Manufacturer Part Number: UPZ2012E601-2R0TF; PartID: 11; Created On: 03.09.2022 16:57:01; ComponentLink1Description: Datasheet; ComponentLink1URL: https://datasheet.lcsc.com/lcsc/2110091730_Sunlord-UPZ2012E601-2R0TF_C98308.pdf; Component Type: Ferrite Beads; Device Package: 0805; Last Updated: 03.09.2022 17:01:04; Mounting Type: SMD; Operating Temperature: -55 - 125 °C; Supplier 1: LCSC; Supplier Part Number 1: C98308; Type: Ferrite Bead; DC current: 2 A; Live Cycle Status: 1; LCSC Part Number: C98308
R3-R5 R50-R52 = RC0603JR-070RL: as R1 on sheet DigitalCarrierJack; Manufacturer Part Number: RC0603JR-070RL; PartID: 1; Created On: 14.12.2020 16:17:14; ComponentLink1Description: Datasheet; ComponentLink1URL: https://www.mouser.de/datasheet/2/447/PYu-RC_Group_51_RoHS_L_10-1664068.pdf; Component Type: SMD resistor; Device Package: 0603; Last Updated: 04.03.2021 09:09:42; Mounting Type: SMD; Supplier 1: Mouser; Supplier Part Number 1: 603-RC0603JR-070RL; Supplier 2: LCSC; Supplier Part Number 2: C21189; Type: Resistor; Value: 0R; Live Cycle Status: 1; Stock number: Labor SMD Container; LCSC Part Number: C21189
R7-R21 = RK73B1JTTD103J: SMD resistor E24 series; Manufacturer: KOA Speer; Tolerance: 5%; Created from: MGremer; Value: 10k; Supplier 1: Mouser; Supplier Part Number 1: 660-RK73B1JTTD103J; Manufacturer Part Number: RK73B1JTTD103J; PartID: 98; Created On: 14.12.2020 16:17:14; ComponentLink1Description: Datasheet; ComponentLink1URL: https://www.mouser.de/datasheet/2/219/RK73B-1825463.pdf; Component Type: SMD resistor; Device Package: 0603; Last Updated: 27.05.2022 14:04:22; Mounting Type: SMD; Type: Resistor; Live Cycle Status: 1; Stock number: Labor SMD Container; LCSC Part Number: C25804
TP1-TP8 TP10 = TP_1mm: Testpoint 1mm; Created: 2018_06_25_AGeiger; Value: Testpoint 1mm
U1 = AD2S1210: Variable Resolution, 10-Bit to 16-Bit R/D Converter with Reference Oscillator; MPN: AD2S1210WDSTZRL7; MF: Analog Devices; Package: LQFP-48; Value: AD2S1210; Created: 2019_04_20_AGeiger; ComponentLink1Description: Datasheet; ComponentLink1URL: https://www.analog.com/media/en/technical-documentation/data-sheets/AD2S1210.pdf; Supplier 1: Mouser; Supplier Part Number 1: 584-AD2S1210WDSTZR7; Supplier Part Number 2: AD2S1210WDSTZRL7CT-ND; Supplier 2: Digi-Key; LCSC Part Number: C408404
X3 = Header 2X2: Header, 2-Pin, Dual row; LatestRevisionDate: 17-Jul-2002; LatestRevisionNote: Re-released for DXP Platform.; Publisher: Altium Limited
X4 = Header 2: Header, 2-Pin; LatestRevisionDate: 17-Jul-2002; LatestRevisionNote: Re-released for DXP Platform.; Publisher: Altium Limited
X5 = DSUB1.385-2H9: Connector; D Subminiature; 9 Position; Right Angle; Pitch 1.385 mm; Manufacturer: TE Connectivity; PackageDocument: O; Positions: 9; Gender: Receptacle; Created from: MHlatky; Published: 15-Jun-2001; LatestRevisionDate: 17-Jul-2002; LatestRevisionNote: Re-released for DXP Platform.; DatasheetDocument: 1-Sep-1999; PackageReference: 788750; Publisher: Altium Limited; Orientation: Right Angle; Manufacturer Part Number: DSUB1.385-2H9; PartID: 5; Created On: 26.01.2021 09:19:51; ComponentLink1Description: Datasheet; ComponentLink1URL: https://www.mouser.de/datasheet/2/418/7/ENG_CD_2311765_D-2072985.pdf; Component Type: DSUB Connector; Device Package: -; Last Updated: 27.05.2022 15:54:50; Supplier 1: Mouser; Supplier Part Number 1: 571-2311765-1; Type: DSUB Connector; Live Cycle Status: 1; LCSC Part Number: C141882; Stock number: not stored
Y1 = SG-8018CE_8.1920M-TJHPA0: 8.192 MHz XO (Standard) CMOS Oscillator 1.62V ~ 3.63V Enable/Disable 4-SMD, No Lead; MPN: SG-8018CE 8.1920M-TJHPA0; MF: EPSON; LCSC Part Number: C390481; Value: SG-8018CE 8.1920M

## Sheet Buffer_EXC.SchDoc
size A4; Author: M. Bauer / A. Geiger; CompanyName: Technische Hochschule Nürnberg Georg Simon Ohm; DrawnBy: Bauer Martin; Engineer: Bauer Martin; Organization: UltraZohm; Address1: Kesslerplatz 12; Address2: 90489 Nürnberg; Address3: GERMANY; DocumentNumber: 4; SheetNumber: 4; SheetTotal: 6; Website: www.ultrazohm.com
Used 3 times, as channels U_Resolver1/Buffer_EXC, U_Resolver2/Buffer_EXC, U_Resolver3/Buffer_EXC. Parts and nets are listed once, with the designators drawn on the sheet.
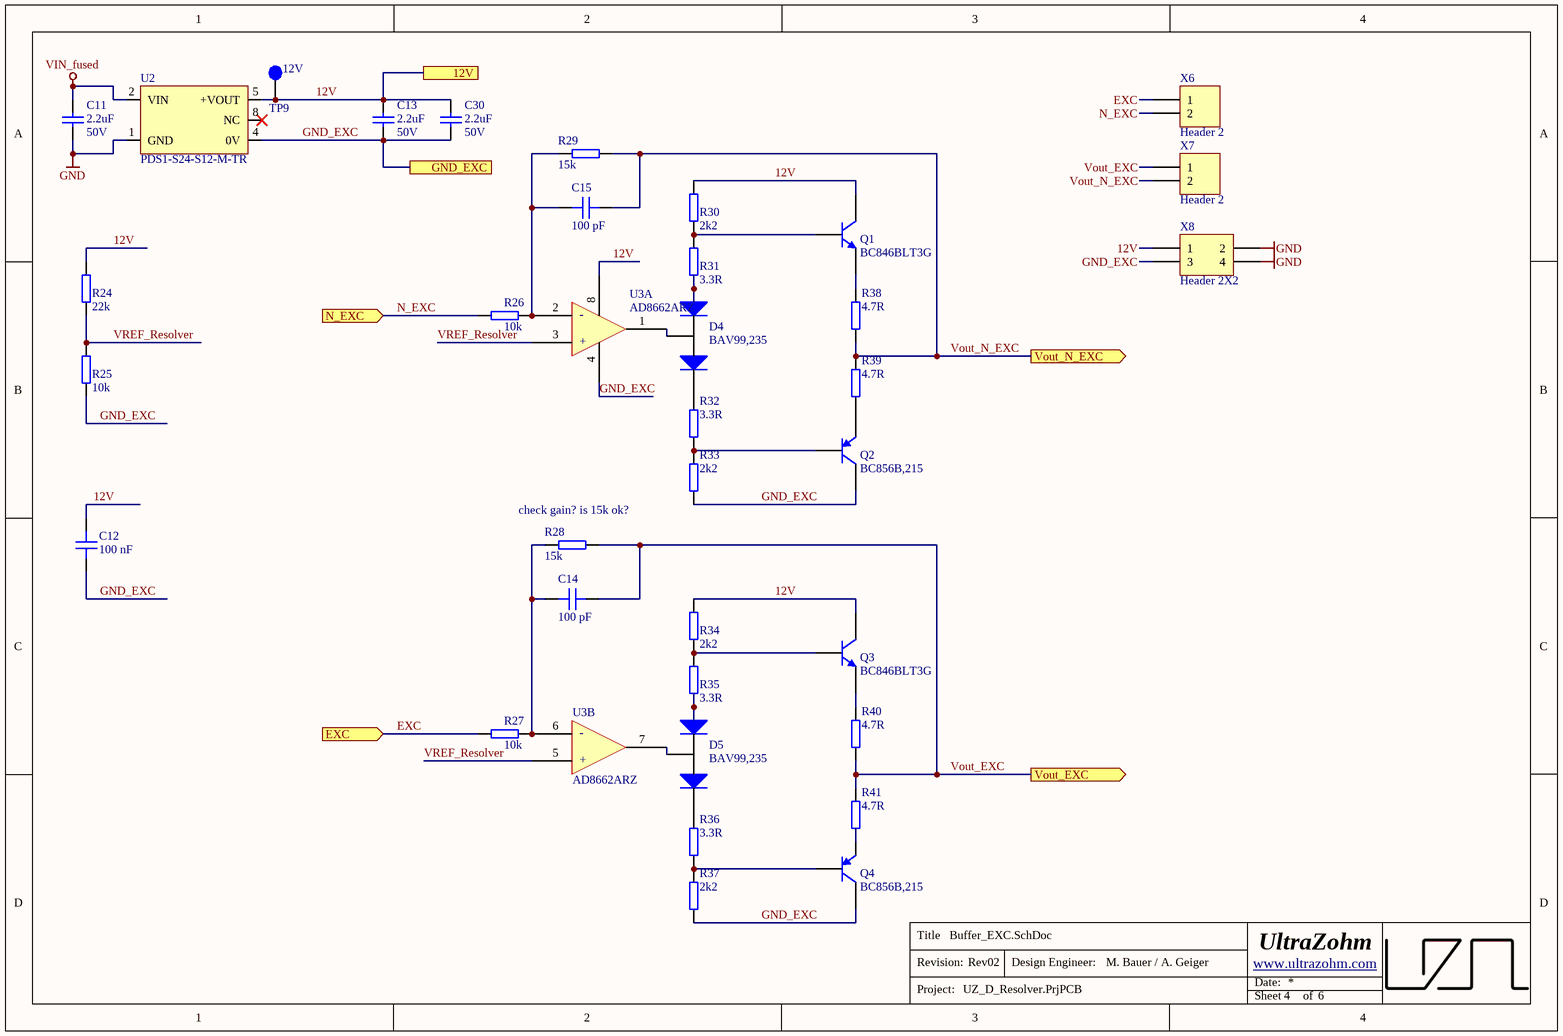
[diagram p3: Buffer_EXC.SchDoc]

### Parts
C11  2.2uF  Voltage: 50V  [RES_1206]
C12  100 nF  [C_0603]
C13  2.2uF  Voltage: 50V  [RES_1206]
C14  100 pF  [C_0603]
C15  100 pF  [C_0603]
C30  2.2uF  Voltage: 50V  [RES_1206]
D4  BAV99,235  [SOT-23]
D5  BAV99,235  [SOT-23]
Q1  BC846BLT3G  [SOT-23]
Q2  BC856B,215  [SOT-23]
Q3  BC846BLT3G  [SOT-23]
Q4  BC856B,215  [SOT-23]
R24  22k  [RES 0603_1608]
R25  10k  [RES 0603_1608]
R26  10k  [RES 0603_1608]
R27  10k  [RES 0603_1608]
R28  15k  [RES 0603_1608]
R29  15k  [RES 0603_1608]
R30  2k2  [RES 0603_1608]
R31  3.3R  [RES 0603_1608]
R32  3.3R  [RES 0603_1608]
R33  2k2  [RES 0603_1608]
R34  2k2  [RES 0603_1608]
R35  3.3R  [RES 0603_1608]
R36  3.3R  [RES 0603_1608]
R37  2k2  [RES 0603_1608]
R38  4.7R  [RES 0603_1608]
R39  4.7R  [RES 0603_1608]
R40  4.7R  [RES 0603_1608]
R41  4.7R  [RES 0603_1608]
TP9  12V  [TP_1mm]  (no BOM)
U2  PDS1-S24-S12-M-TR  [DC/DC 24V-->12V 1W Aislado]
U3  AD8662ARZ  [SOIC8_N]  (parts A,B of 2)
X6  Header 2  [HDR1X2]
X7  Header 2  [HDR1X2]
X8  Header 2X2  [HDR2X2]

### Ports
12V, EXC (in), GND_EXC, N_EXC (in), Vout_EXC (out), Vout_N_EXC (out)

### Nets
GND: C11.2 U2.1(GND) X8.2 X8.4
VIN_fused: C11.1 U2.2(VIN)
12V: C12.1 C13.1 C30.1 Q1.3(C) Q3.3(C) R24.2 R30.2 R34.2 TP9.1 U2.5(+VOUT) U3.8(v-) X8.1 ; port 12V
EXC: R27.2 X6.1 ; port EXC
GND_EXC: C12.2 C13.2 C30.2 Q2.3(C) Q4.3(C) R25.1 R33.2 R37.2 U2.4(0V) U3.4(v+) X8.3 ; port GND_EXC
N_EXC: R26.2 X6.2 ; port N_EXC
Vout_EXC: C14.2 R28.2 R40.2 R41.1 X7.1 ; port Vout_EXC
Vout_N_EXC: C15.2 R29.2 R38.2 R39.1 X7.2 ; port Vout_N_EXC
VREF_Resolver: R24.1 R25.2 U3.3(+in_a) U3.5(+in_b)
NetC14_1: C14.1 R27.1 R28.1 U3.6(-in_b)
NetC15_1: C15.1 R26.1 R29.1 U3.2(-in_a)
NetD4_1: D4.1 R31.1
NetD4_2: D4.2 R32.1
NetD4_3: D4.3 U3.1(out_a)
NetD5_1: D5.1 R35.1
NetD5_2: D5.2 R36.1
NetD5_3: D5.3 U3.7(out_b)
NetQ1_1: Q1.1(B) R30.1 R31.2
NetQ1_2: Q1.2(E) R38.1
NetQ2_1: Q2.1(B) R32.2 R33.1
NetQ2_2: Q2.2(E) R39.2
NetQ3_1: Q3.1(B) R34.1 R35.2
NetQ3_2: Q3.2(E) R40.1
NetQ4_1: Q4.1(B) R36.2 R37.1
NetQ4_2: Q4.2(E) R41.2

Not connected (* = marked no-connect by the designer): U2 8(NC)* 15(NC) 16(NC) 17(NC) 26(NC) 27(NC)

### Channels
U_Resolver1/Buffer_EXC: designators end in A; ports 12V=12V_U_Resolver1 EXC=EXC_U_Resolver1 GND_EXC=GND_EXC_U_Resolver1 N_EXC=N_EXC_U_Resolver1 Vout_EXC=D_EXC_U_Resolver1 Vout_N_EXC=D_EXC_N_U_Resolver1
U_Resolver2/Buffer_EXC: designators end in B; ports 12V=12V_U_Resolver2 EXC=EXC_U_Resolver2 GND_EXC=GND_EXC_U_Resolver2 N_EXC=N_EXC_U_Resolver2 Vout_EXC=D_EXC_U_Resolver2 Vout_N_EXC=D_EXC_N_U_Resolver2
U_Resolver3/Buffer_EXC: designators end in C; ports 12V=12V_U_Resolver3 EXC=EXC_U_Resolver3 GND_EXC=GND_EXC_U_Resolver3 N_EXC=N_EXC_U_Resolver3 Vout_EXC=D_EXC_U_Resolver3 Vout_N_EXC=D_EXC_N_U_Resolver3

### Notes on the sheet
- check gain? is 15k ok?
- Title
- Revision:
- Design Engineer:
- Date:
- Project:
- Sheet
- of
- (in symbol AD8662, part A) -; +
- (in symbol AD8662, part B) -; +

### Library data of the parts
C11 C13 C30 = Cap_1206: Capacitor; Digikey Part-Number: *; Value: 2.2uF; Manufacturer Part-Number: *; LCSC Part Number: C50254
C12 = CC0603KRX7R9BB104: as C4 on sheet Resolver; Value: 100 nF; Supplier 1: LCSC; Supplier 2: Mouser; Supplier Part Number 1: C14663; Supplier Part Number 2: 603-CC603KRX7R9BB104; Manufacturer Part Number: CC0603KRX7R9BB104; PartID: 102; Created On: 22.08.2022 14:35:53; ComponentLink1Description: Datasheet; ComponentLink1URL: https://datasheet.lcsc.com/lcsc/1809301912_YAGEO-CC0603KRX7R9BB104_C14663.pdf; Component Type: Capacitor 0603; Device Package: 0603; Last Updated: 22.08.2022 14:35:53; Mounting Type: SMD; Operating Temperature: -55 - 125°C; Series: X7R; Type: Capacitor; Live Cycle Status: 1; LCSC Part Number: C14663
C14 C15 = CL10C101JB8NNNC: 50V 100pF C0G ±5% 0603 Multilayer Ceramic Capacitors MLCC - SMD/SMT ROHS; Manufacturer: Samsung Electro-Mechanics; Voltage Rating: 50 VDC; Created from: AGeiger; Value: 100 pF; Supplier 1: LCSC; Supplier Part Number 1: C14858; Manufacturer Part Number: CL10C101JB8NNNC; PartID: 106; Created On: 03.09.2022 10:55:28; ComponentLink1Description: Datasheet; ComponentLink1URL: https://datasheet.lcsc.com/lcsc/1811151136_Samsung-Electro-Mechanics-CL10C101JB8NNNC_C14858.pdf; Component Type: Capacitor 0603; Device Package: 0603; Last Updated: 03.09.2022 10:55:28; Mounting Type: SMD; Operating Temperature: -55 - 125°C; Series: C0G; Type: Capacitor; Tolerance: 5 %; Live Cycle Status: 1; LCSC Part Number: C14858
D4 D5 = Diode Array: DIODE ARRAY GP 100V 215MA SOT23; MF: Nexperia; Supplier Part Number 2: 1727-4311-1-ND; MPN: BAV99,235; Supplier 1: Mouser; Supplier 2: Digi-Key; Package: SOT-23-3; Supplier Part Number 1: 771-BAV99235; LCSC Part Number: C2500
Q1 Q3 = NPN Transistor BC846: NPN Bipolar Transistor; MF: ON Semiconductor; Supplier Part Number 2: BC846BLT3GOSCT-ND; MPN: BC846BLT3G; Supplier 1: Mouser; Supplier 2: Digi-Key; Supplier Part Number 1: 863-BC846BLT3G; Package: SOT-23-3; LCSC Part Number: C513271
Q2 Q4 = PNP Transistor BC846: PNP Bipolar Transistor; MF: Nexperia; Supplier Part Number 2: 1727-2925-1-ND; MPN: BC856B,215; Supplier Part Number 1: 771-BC856B-T/R; Supplier 1: Mouser; Supplier 2: Digi-Key; Package: SOT-23-3; LCSC Part Number: C109310
R24 = RK73B1JTTD223J: as R6 on sheet DigitalCarrierJack; Value: 22k; Supplier 1: Mouser; Supplier Part Number 1: 660-RK73B1JTTD223J; Manufacturer Part Number: RK73B1JTTD223J; PartID: 106; Created On: 14.12.2020 16:17:14; ComponentLink1Description: Datasheet; ComponentLink1URL: https://www.mouser.de/datasheet/2/219/RK73B-1825463.pdf; Component Type: SMD resistor; Device Package: 0603; Last Updated: 01.02.2023 09:52:31; Mounting Type: SMD; Type: Resistor; Live Cycle Status: 1; Stock number: Labor SMD Container; LCSC Part Number: C31850
R25-R27 = RK73B1JTTD103J: as R7 on sheet Resolver; Value: 10k; Supplier 1: Mouser; Supplier Part Number 1: 660-RK73B1JTTD103J; Manufacturer Part Number: RK73B1JTTD103J; PartID: 98; Created On: 14.12.2020 16:17:14; ComponentLink1Description: Datasheet; ComponentLink1URL: https://www.mouser.de/datasheet/2/219/RK73B-1825463.pdf; Component Type: SMD resistor; Device Package: 0603; Last Updated: 27.05.2022 14:04:22; Mounting Type: SMD; Type: Resistor; Live Cycle Status: 1; Stock number: Labor SMD Container; LCSC Part Number: C25804
R28 R29 = RK73B1JTTD153J: SMD resistor E24 series; Manufacturer: KOA Speer; Tolerance: 5%; Created from: MGremer; Value: 15k; Supplier 1: Mouser; Supplier Part Number 1: 660-RK73B1JTTD153J; Manufacturer Part Number: RK73B1JTTD153J; PartID: 102; Created On: 14.12.2020 16:17:14; ComponentLink1Description: Datasheet; ComponentLink1URL: https://www.mouser.de/datasheet/2/219/RK73B-1825463.pdf; Component Type: SMD resistor; Device Package: 0603; Last Updated: 27.05.2022 13:41:55; Mounting Type: SMD; Type: Resistor; Live Cycle Status: 1; Stock number: Labor SMD Container; LCSC Part Number: C22809
R30 R33 R34 R37 = RK73B1JTTD222J: SMD resistor E24 series; Manufacturer: KOA Speer; Tolerance: 5%; Created from: MGremer; Value: 2k2; Supplier 1: Mouser; Supplier Part Number 1: 660-RK73B1JTTD222J; Manufacturer Part Number: RK73B1JTTD222J; PartID: 82; Created On: 14.12.2020 16:17:14; ComponentLink1Description: Datasheet; ComponentLink1URL: https://www.mouser.de/datasheet/2/219/RK73B-1825463.pdf; Component Type: SMD resistor; Device Package: 0603; Last Updated: 31.01.2023 21:49:41; Mounting Type: SMD; Type: Resistor; Live Cycle Status: 1; Stock number: Labor SMD Container; LCSC Part Number: C4190
R31 R32 R35 R36 = RK73B1JTTDD3R3J: SMD resistor E24 series; Manufacturer: KOA Speer; Tolerance: 5%; Created from: MGremer; Value: 3.3R; Supplier 1: Mouser; Supplier Part Number 1: 660-RK73B1JTTDD3R3J; Manufacturer Part Number: RK73B1JTTDD3R3J; PartID: 14; Created On: 14.12.2020 16:17:14; ComponentLink1Description: Datasheet; ComponentLink1URL: https://www.mouser.de/datasheet/2/219/RK73B-1825463.pdf; Component Type: SMD resistor; Device Package: 0603; Last Updated: 31.01.2023 21:46:34; Mounting Type: SMD; Type: Resistor; Live Cycle Status: 1; Stock number: Labor SMD Container; LCSC Part Number: C25238
R38-R41 = RK73B1JTTDD4R7J: SMD resistor E24 series; Manufacturer: KOA Speer; Tolerance: 5%; Created from: MGremer; Value: 4.7R; Supplier 1: Mouser; Supplier Part Number 1: 660-RK73B1JTTDD4R7J; Manufacturer Part Number: RK73B1JTTDD4R7J; PartID: 18; Created On: 14.12.2020 16:17:14; ComponentLink1Description: Datasheet; ComponentLink1URL: https://www.mouser.de/datasheet/2/219/RK73B-1825463.pdf; Component Type: SMD resistor; Device Package: 0603; Last Updated: 31.01.2023 21:53:12; Mounting Type: SMD; Type: Resistor; Live Cycle Status: 1; Stock number: Labor SMD Container; LCSC Part Number: C23164
TP9 = TP_1mm: Testpoint 1mm; Created: 2018_06_25_AGeiger; Value: Testpoint 1mm
U2 = DC/DC +12V 1W: DC DC CONVERTER 12V 1W; MF: CUI; MPN: PDS1-S24-S12-M-TR; Supplier Part Number 2: 102-3406-1-ND; Package: 5-SMD; Supplier 1: Mouser; Supplier 2: Digi-Key; Supplier Part Number 1: 490-PDS1S24S12MTR; LCSC Part Number: C5707797
U3 = AD8662: IC OPAMP GP 2 CIRCUIT 14SOIC; MF: Analog Devices; MPN: AD8662ARZ; Supplier Part Number 2: AD8662ARZ-ND; Package: SOIC-8; Supplier 1: Mouser; Supplier 2: Digi-Key; Supplier Part Number 1: 584-AD8662ARZ; LCSC Part Number: C28133
X6 X7 = Header 2: Header, 2-Pin; LatestRevisionDate: 17-Jul-2002; LatestRevisionNote: Re-released for DXP Platform.; Publisher: Altium Limited
X8 = Header 2X2: Header, 2-Pin, Dual row; LatestRevisionDate: 17-Jul-2002; LatestRevisionNote: Re-released for DXP Platform.; Publisher: Altium Limited

## Sheet Impedance converter.SchDoc
size A4; Author: M. Bauer / A. Geiger; CompanyName: Technische Hochschule Nürnberg Georg Simon Ohm; DrawnBy: Bauer Martin; Engineer: Bauer Martin; Organization: UltraZohm; Address1: Kesslerplatz 12; Address2: 90489 Nürnberg; Address3: GERMANY; DocumentNumber: 5; SheetNumber: 5; SheetTotal: 6; Website: www.ultrazohm.com
Used 3 times, as channels U_Resolver1/Impedance Converter, U_Resolver2/Impedance Converter, U_Resolver3/Impedance Converter. Parts and nets are listed once, with the designators drawn on the sheet.
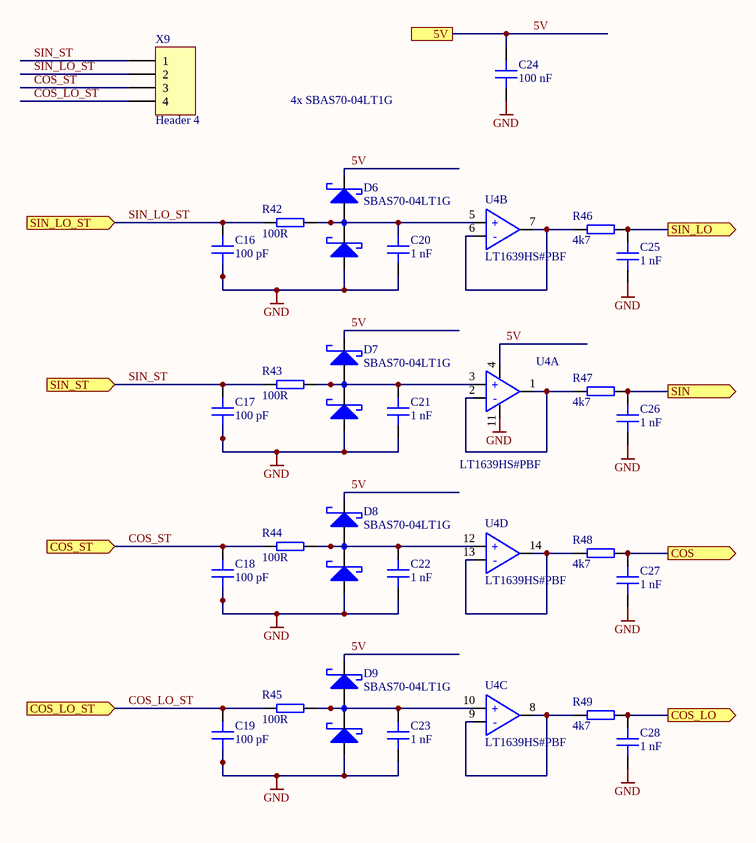
[diagram p4: Impedance converter.SchDoc]

### Parts
C16  100 pF  [C_0603]
C17  100 pF  [C_0603]
C18  100 pF  [C_0603]
C19  100 pF  [C_0603]
C20  1 nF  [C_0603]
C21  1 nF  [C_0603]
C22  1 nF  [C_0603]
C23  1 nF  [C_0603]
C24  100 nF  [C_0603]
C25  1 nF  [C_0603]
C26  1 nF  [C_0603]
C27  1 nF  [C_0603]
C28  1 nF  [C_0603]
D6  SBAS70-04LT1G  [SOT-23]
D7  SBAS70-04LT1G  [SOT-23]
D8  SBAS70-04LT1G  [SOT-23]
D9  SBAS70-04LT1G  [SOT-23]
R42  100R  [RES 0603_1608]
R43  100R  [RES 0603_1608]
R44  100R  [RES 0603_1608]
R45  100R  [RES 0603_1608]
R46  4k7  [RES 0603_1608]
R47  4k7  [RES 0603_1608]
R48  4k7  [RES 0603_1608]
R49  4k7  [RES 0603_1608]
U4  LT1639HS#PBF  [SOIC-14]  (parts A,B,C,D of 4)
X9  Header 4  [HDR1X4]

### Ports
5V, COS (out), COS_LO (out), COS_LO_ST (in), COS_ST (in), SIN (out), SIN_LO (out), SIN_LO_ST (in), SIN_ST (in)

### Nets
GND: C16.2 C17.2 C18.2 C19.2 C20.2 C21.2 C22.2 C23.2 C24.2 C25.2 C26.2 C27.2 C28.2 D6.1 D7.1 D8.1 D9.1 U4.11(V-)
5V: C24.1 D6.2 D7.2 D8.2 D9.2 U4.4(V+) ; port 5V
COS: C27.1 R48.2 ; port COS
COS_LO: C28.1 R49.2 ; port COS_LO
COS_LO_ST: C19.1 R45.1 X9.4 ; port COS_LO_ST
COS_ST: C18.1 R44.1 X9.3 ; port COS_ST
SIN: C26.1 R47.2 ; port SIN
SIN_LO: C25.1 R46.2 ; port SIN_LO
SIN_LO_ST: C16.1 R42.1 X9.2 ; port SIN_LO_ST
SIN_ST: C17.1 R43.1 X9.1 ; port SIN_ST
NetC20_1: C20.1 D6.3 R42.2 U4.5(+)
NetC21_1: C21.1 D7.3 R43.2 U4.3(+)
NetC22_1: C22.1 D8.3 R44.2 U4.12(+)
NetC23_1: C23.1 D9.3 R45.2 U4.10(+)
NetR46_1: R46.1 U4.6(-) U4.7
NetR47_1: R47.1 U4.1 U4.2(-)
NetR48_1: R48.1 U4.13(-) U4.14
NetR49_1: R49.1 U4.8 U4.9(-)

### Channels
U_Resolver1/Impedance Converter: designators end in A; ports 5V=5V_U_Resolver1 COS=COS_U_Resolver1 COS_LO=COS_LO_U_Resolver1 COS_LO_ST=COS_LO_ST COS_ST=COS_ST SIN=SIN_U_Resolver1 SIN_LO=SIN_LO_U_Resolver1 SIN_LO_ST=D_SIN_LO_U_Resolver1 SIN_ST=D_SIN_U_Resolver1
U_Resolver2/Impedance Converter: designators end in B; ports 5V=5V_U_Resolver2 COS=COS_U_Resolver2 COS_LO=COS_LO_U_Resolver2 COS_LO_ST=COS_LO_ST COS_ST=COS_ST SIN=SIN_U_Resolver2 SIN_LO=SIN_LO_U_Resolver2 SIN_LO_ST=D_SIN_LO_U_Resolver2 SIN_ST=D_SIN_U_Resolver2
U_Resolver3/Impedance Converter: designators end in C; ports 5V=5V_U_Resolver3 COS=COS_U_Resolver3 COS_LO=COS_LO_U_Resolver3 COS_LO_ST=COS_LO_ST COS_ST=COS_ST SIN=SIN_U_Resolver3 SIN_LO=SIN_LO_U_Resolver3 SIN_LO_ST=D_SIN_LO_U_Resolver3 SIN_ST=D_SIN_U_Resolver3

### Notes on the sheet
- 4x SBAS70-04LT1G
- Title
- Revision:
- Design Engineer:
- Date:
- Project:
- Sheet
- of

### Library data of the parts
C16-C19 = CL10C101JB8NNNC: as C14 on sheet Buffer_EXC; Value: 100 pF; Supplier 1: LCSC; Supplier Part Number 1: C14858; Manufacturer Part Number: CL10C101JB8NNNC; PartID: 106; Created On: 03.09.2022 10:55:28; ComponentLink1Description: Datasheet; ComponentLink1URL: https://datasheet.lcsc.com/lcsc/1811151136_Samsung-Electro-Mechanics-CL10C101JB8NNNC_C14858.pdf; Component Type: Capacitor 0603; Device Package: 0603; Last Updated: 03.09.2022 10:55:28; Mounting Type: SMD; Operating Temperature: -55 - 125°C; Series: C0G; Type: Capacitor; Tolerance: 5 %; Live Cycle Status: 1; LCSC Part Number: C14858
C20-C23 C25-C28 = CC0603JRNPO9BN102: Capacitor 0603, 50 VDC, 1 nF, NP0; Manufacturer: YAGEO; Tolerance: 5 %; Voltage Rating: 50 VDC; Created from: AGeiger; Value: 1 nF; Supplier 1: LCSC; Supplier Part Number 1: C106246; Manufacturer Part Number: CC0603JRNPO9BN102; PartID: 104; Created On: 30.08.2022 11:46:28; ComponentLink1Description: Datasheet; ComponentLink1URL: https://datasheet.lcsc.com/lcsc/1811021411_YAGEO-CC0603JRNPO9BN102_C106246.pdf; Component Type: Capacitor 0603; Device Package: 0603; Last Updated: 30.08.2022 11:46:28; Mounting Type: SMD; Operating Temperature: -55 - 125°C; Series: NP0; Type: Capacitor; Live Cycle Status: 1; LCSC Part Number: C106246
C24 = CC0603KRX7R9BB104: as C4 on sheet Resolver; Value: 100 nF; Supplier 1: LCSC; Supplier 2: Mouser; Supplier Part Number 1: C14663; Supplier Part Number 2: 603-CC603KRX7R9BB104; Manufacturer Part Number: CC0603KRX7R9BB104; PartID: 102; Created On: 22.08.2022 14:35:53; ComponentLink1Description: Datasheet; ComponentLink1URL: https://datasheet.lcsc.com/lcsc/1809301912_YAGEO-CC0603KRX7R9BB104_C14663.pdf; Component Type: Capacitor 0603; Device Package: 0603; Last Updated: 22.08.2022 14:35:53; Mounting Type: SMD; Operating Temperature: -55 - 125°C; Series: X7R; Type: Capacitor; Live Cycle Status: 1; LCSC Part Number: C14663
D6-D9 = Diode Array Schottky: DIODE SCHOTTKY 70V DUAL SOT23; MF: ON Semiconductor; Supplier Part Number 2: SBAS70-04LT1GOSCT-ND; MPN: SBAS70-04LT1G; Supplier Part Number 1: 863-SBAS70-04LT1G; Package: SOT-23-3; Supplier 1: Mouser; Supplier 2: Digi-Key; LCSC Part Number: C389351
R42-R45 = RK73B1JTTD101J: SMD resistor E24 series; Manufacturer: KOA Speer; Tolerance: 5%; Created from: MGremer; Value: 100R; Supplier 1: Mouser; Supplier Part Number 1: 660-RK73B1JTTD101J; Manufacturer Part Number: RK73B1JTTD101J; PartID: 50; Created On: 14.12.2020 16:17:14; ComponentLink1Description: Datasheet; ComponentLink1URL: https://www.mouser.de/datasheet/2/219/RK73B-1825463.pdf; Component Type: SMD resistor; Device Package: 0603; Last Updated: 29.11.2022 14:30:07; Mounting Type: SMD; Supplier 2: LCSC; Supplier Part Number 2: C22775; Type: Resistor; Live Cycle Status: 1; Stock number: Labor SMD Container; LCSC Part Number: C22775
R46-R49 = 0603WAF4701T5E: as R55 on sheet DigitalCarrierJack; Value: 4k7; Supplier 1: LCSC; Supplier Part Number 1: C23162; Manufacturer Part Number: 0603WAF4701T5E; PartID: 90; Created On: 14.12.2020 16:17:14; ComponentLink1Description: Datasheet; ComponentLink1URL: https://datasheet.lcsc.com/lcsc/2206010116_UNI-ROYAL-Uniroyal-Elec-0603WAF4701T5E_C23162.pdf; Component Type: SMD resistor; Device Package: 0603; Last Updated: 25.08.2022 20:03:04; Mounting Type: SMD; Type: Resistor; Live Cycle Status: 1; Stock number: Labor SMD Container; LCSC Part Number: C23162
U4 = LT1639CS: IC OPAMP GP 4 CIRCUIT 14SO; MPN: LT1639CS#PBF; MF: Analog Devices; Supplier Part Number 2: LT1639CS#PBF-ND; Supplier Part Number 1: 584-LT1639CS#PBF; Package: SO-14; Supplier 1: Mouser; Supplier 2: Digikey; LCSC Part Number: C579803
X9 = Header 4: Header, 4-Pin; LatestRevisionDate: 17-Jul-2002; LatestRevisionNote: Re-released for DXP Platform.; Publisher: Altium Limited